# Altium schematic sheet DigitalPart.SchDoc
size 254 x 254 mm; PageSetup: Record=PageOptions|CenterHorizontal=False|CenterVertical=True|PrintScale=1.00|XCorrection=1.00|YCorrection=1.00|PrintKind=2|BorderSize=5000000|LeftOffset=0|BottomOffset=0|Orientation=1|PaperLength=1000|PaperWidth=1000|Scale=100|PaperSource=7|PrintQuality=-4|MediaType=1|DitherType=10|PaperKind=A4|PrintScaleMode=0
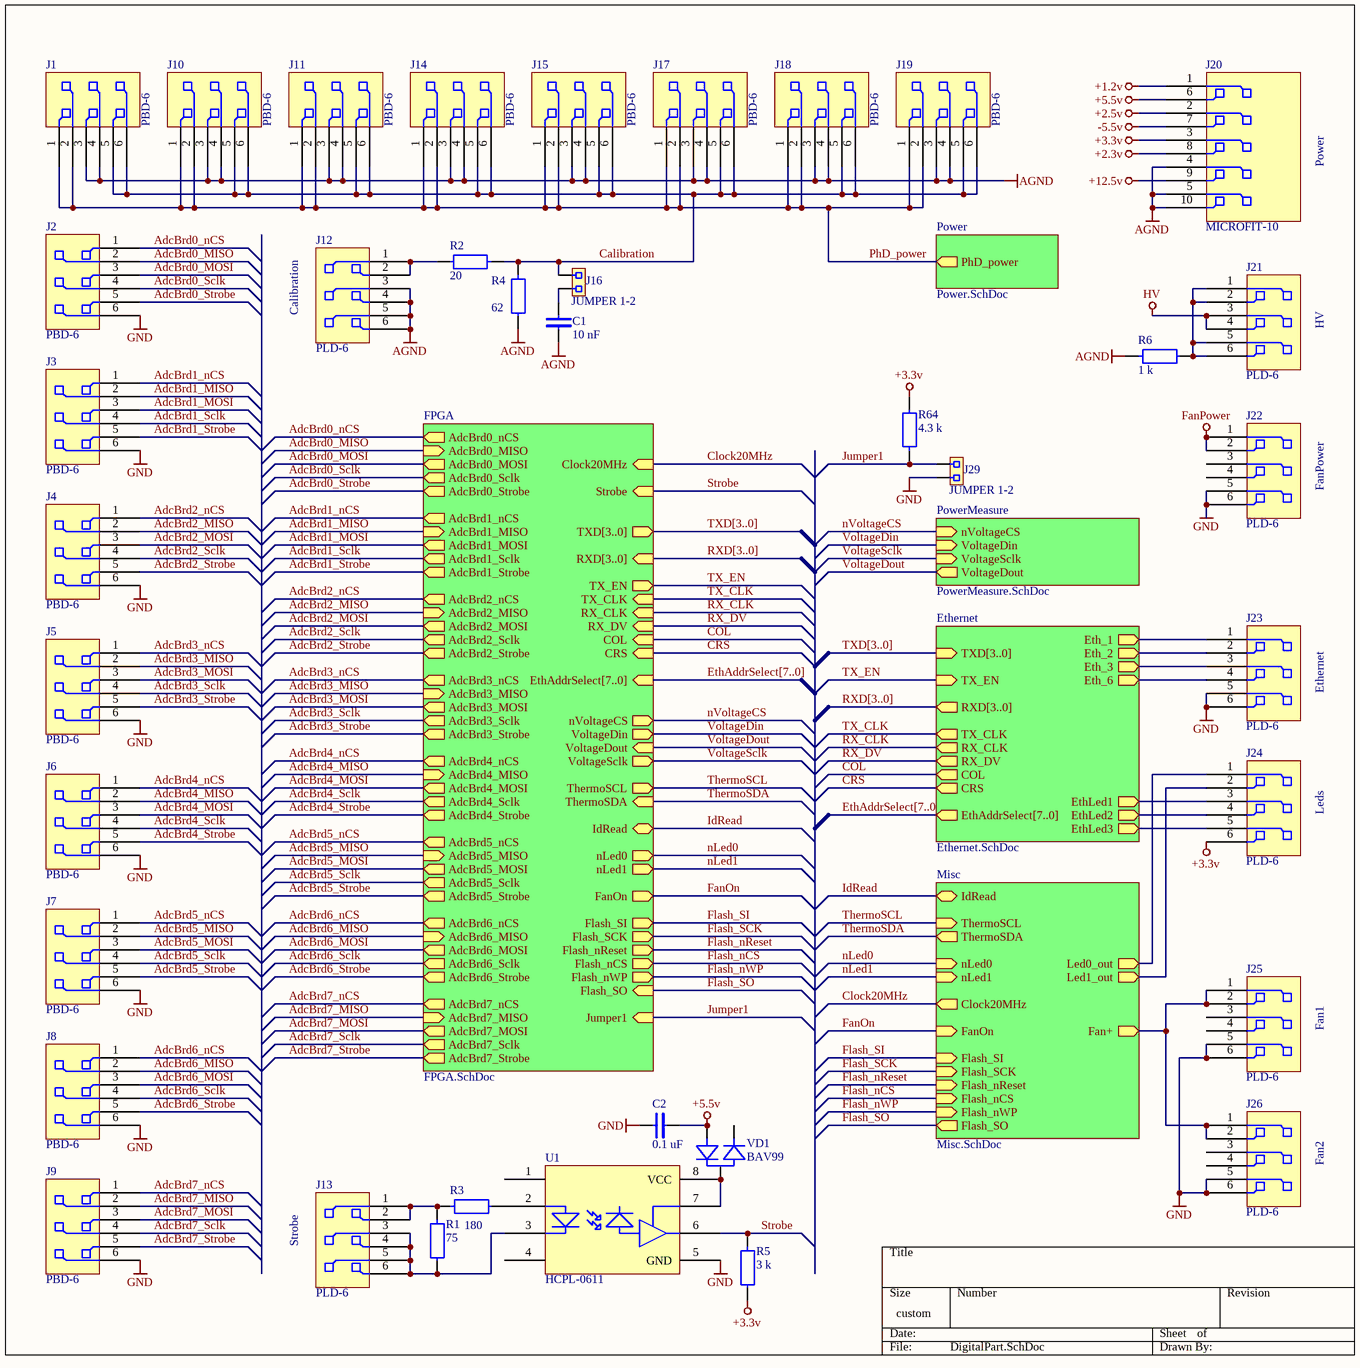
[diagram p0: DigitalPart.SchDoc]

## Parts
C1  10 nF  [1206]
C2  0.1 uF  [1206]
J1  PBD-6  [PBD-6]
J2  PBD-6  [PBD-6]
J3  PBD-6  [PBD-6]
J4  PBD-6  [PBD-6]
J5  PBD-6  [PBD-6]
J6  PBD-6  [PBD-6]
J7  PBD-6  [PBD-6]
J8  PBD-6  [PBD-6]
J9  PBD-6  [PBD-6]
J10  PBD-6  [PBD-6]
J11  PBD-6  [PBD-6]
J12  PLD-6  [PLD-6]
J13  PLD-6  [PLD-6]
J14  PBD-6  [PBD-6]
J15  PBD-6  [PBD-6]
J16  JUMPER 1-2  [2SIP]
J17  PBD-6  [PBD-6]
J18  PBD-6  [PBD-6]
J19  PBD-6  [PBD-6]
J20  MICROFIT-10  [MicroFit10]
J21  PLD-6  [PLD-6]
J22  PLD-6  [PLD-6]
J23  PLD-6  [PLD-6]
J24  PLD-6  [PLD-6]
J25  PLD-6  [PLD-6]
J26  PLD-6  [PLD-6]
J29  JUMPER 1-2  [2SIP]
R1  75  [1206]
R2  20  [1206]
R3  180  [1206]
R4  62  [1206]
R5  3 k  [1206]
R6  1 k  [1206]
R64  4.3 k  [0603]
U1  HCPL-0611  [8SOIC150]
VD1  BAV99  [SOT-23]

## Sub-sheets
Ethernet = Ethernet.SchDoc: COL (out), TX_EN (in), TX_CLK (out), RX_CLK (out), RX_DV (out), TXD[3..0] (in), RXD[3..0] (out), CRS (out), EthAddrSelect[7..0] (out), Eth_1 (out), Eth_2 (out), Eth_3 (out), Eth_6 (out), EthLed3 (out), EthLed2 (out), EthLed1 (out)
FPGA = FPGA.SchDoc: AdcBrd0_nCS (out), AdcBrd0_MISO (in), AdcBrd0_MOSI (out), AdcBrd0_Strobe (out), AdcBrd0_Sclk (out), nVoltageCS (out), VoltageDin (out), VoltageSclk (out), VoltageDout (in), COL (in), TX_EN (out), TX_CLK (in), RX_CLK (in), RX_DV (in), TXD[3..0] (out), CRS (in), RXD[3..0] (in), IdRead (bidir), ThermoSDA (in), Clock20MHz (in), ThermoSCL (out), nLed0 (out), nLed1 (out), Strobe (in), AdcBrd1_nCS (out), AdcBrd1_MISO (in), AdcBrd1_MOSI (out), AdcBrd1_Strobe (out), AdcBrd1_Sclk (out), AdcBrd2_nCS (out), AdcBrd2_MISO (in), AdcBrd2_MOSI (out), AdcBrd2_Strobe (out), AdcBrd2_Sclk (out), AdcBrd3_nCS (out), AdcBrd3_MISO (in), AdcBrd3_MOSI (out), AdcBrd3_Strobe (out), AdcBrd3_Sclk (out), AdcBrd4_nCS (out), AdcBrd4_MISO (in), AdcBrd4_MOSI (out), AdcBrd4_Strobe (out), AdcBrd4_Sclk (out), AdcBrd5_nCS (out), AdcBrd5_MISO (in), AdcBrd5_MOSI (out), AdcBrd5_Strobe (out), AdcBrd5_Sclk (out), AdcBrd6_nCS (out), AdcBrd6_MISO (in), AdcBrd6_MOSI (out), AdcBrd6_Strobe (out), AdcBrd6_Sclk (out), AdcBrd7_nCS (out), AdcBrd7_MISO (in), AdcBrd7_MOSI (out), AdcBrd7_Strobe (out), AdcBrd7_Sclk (out), EthAddrSelect[7..0] (in), FanOn (out), Flash_SI (out), Flash_SCK (out), Flash_nReset (out), Flash_nCS (out), Flash_nWP (out), Flash_SO (in), Jumper1 (in)
Misc = Misc.SchDoc: IdRead (bidir), ThermoSDA (out), Clock20MHz (out), ThermoSCL (in), nLed0 (in), nLed1 (in), Fan+ (out), FanOn (in), Flash_SI (in), Flash_SCK (in), Flash_nReset (in), Flash_nCS (in), Flash_nWP (in), Flash_SO (out), Led0_out (out), Led1_out (out)
Power = Power.SchDoc: PhD_power (out)
PowerMeasure = PowerMeasure.SchDoc: nVoltageCS (in), VoltageDin (in), VoltageSclk (in), VoltageDout (out)

## Nets
+1.2v: J20.1
+2.3v: J20.8
+2.5v: J20.2
+3.3v: J20.3 J24.6 R5.1 R64.1
+5.5v: C2.2 J20.6 VD1.1
+12.5v: J20.9
-5.5v: J20.7
AGND: C1.1 J1.3 J1.4 J10.3 J10.4 J11.3 J11.4 J12.3 J12.4 J12.5 J12.6 J14.3 J14.4 J15.3 J15.4 J17.3 J17.4 J18.3 J18.4 J19.3 J19.4 J20.4 J20.5 J20.10 R4.1 R6.2
FanPower: J22.1 J22.2
GND: C2.1 J2.6 J3.6 J4.6 J5.6 J6.6 J7.6 J8.6 J9.6 J22.5 J22.6 J23.5 J23.6 J25.5 J25.6 J26.5 J26.6 J29.2 U1.5(GND)
HV: J21.3 J21.4
AdcBrd0_MISO: J2.2 ; sheet FPGA/AdcBrd0_MISO
AdcBrd0_MOSI: J2.3 ; sheet FPGA/AdcBrd0_MOSI
AdcBrd0_nCS: J2.1 ; sheet FPGA/AdcBrd0_nCS
AdcBrd0_Sclk: J2.4 ; sheet FPGA/AdcBrd0_Sclk
AdcBrd0_Strobe: J2.5 ; sheet FPGA/AdcBrd0_Strobe
AdcBrd1_MISO: J3.2 ; sheet FPGA/AdcBrd1_MISO
AdcBrd1_MOSI: J3.3 ; sheet FPGA/AdcBrd1_MOSI
AdcBrd1_nCS: J3.1 ; sheet FPGA/AdcBrd1_nCS
AdcBrd1_Sclk: J3.4 ; sheet FPGA/AdcBrd1_Sclk
AdcBrd1_Strobe: J3.5 ; sheet FPGA/AdcBrd1_Strobe
AdcBrd2_MISO: J4.2 ; sheet FPGA/AdcBrd2_MISO
AdcBrd2_MOSI: J4.3 ; sheet FPGA/AdcBrd2_MOSI
AdcBrd2_nCS: J4.1 ; sheet FPGA/AdcBrd2_nCS
AdcBrd2_Sclk: J4.4 ; sheet FPGA/AdcBrd2_Sclk
AdcBrd2_Strobe: J4.5 ; sheet FPGA/AdcBrd2_Strobe
AdcBrd3_MISO: J5.2 ; sheet FPGA/AdcBrd3_MISO
AdcBrd3_MOSI: J5.3 ; sheet FPGA/AdcBrd3_MOSI
AdcBrd3_nCS: J5.1 ; sheet FPGA/AdcBrd3_nCS
AdcBrd3_Sclk: J5.4 ; sheet FPGA/AdcBrd3_Sclk
AdcBrd3_Strobe: J5.5 ; sheet FPGA/AdcBrd3_Strobe
AdcBrd4_MISO: J6.2 ; sheet FPGA/AdcBrd4_MISO
AdcBrd4_MOSI: J6.3 ; sheet FPGA/AdcBrd4_MOSI
AdcBrd4_nCS: J6.1 ; sheet FPGA/AdcBrd4_nCS
AdcBrd4_Sclk: J6.4 ; sheet FPGA/AdcBrd4_Sclk
AdcBrd4_Strobe: J6.5 ; sheet FPGA/AdcBrd4_Strobe
AdcBrd5_MISO: J7.2 ; sheet FPGA/AdcBrd5_MISO
AdcBrd5_MOSI: J7.3 ; sheet FPGA/AdcBrd5_MOSI
AdcBrd5_nCS: J7.1 ; sheet FPGA/AdcBrd5_nCS
AdcBrd5_Sclk: J7.4 ; sheet FPGA/AdcBrd5_Sclk
AdcBrd5_Strobe: J7.5 ; sheet FPGA/AdcBrd5_Strobe
AdcBrd6_MISO: J8.2 ; sheet FPGA/AdcBrd6_MISO
AdcBrd6_MOSI: J8.3 ; sheet FPGA/AdcBrd6_MOSI
AdcBrd6_nCS: J8.1 ; sheet FPGA/AdcBrd6_nCS
AdcBrd6_Sclk: J8.4 ; sheet FPGA/AdcBrd6_Sclk
AdcBrd6_Strobe: J8.5 ; sheet FPGA/AdcBrd6_Strobe
AdcBrd7_MISO: J9.2 ; sheet FPGA/AdcBrd7_MISO
AdcBrd7_MOSI: J9.3 ; sheet FPGA/AdcBrd7_MOSI
AdcBrd7_nCS: J9.1 ; sheet FPGA/AdcBrd7_nCS
AdcBrd7_Sclk: J9.4 ; sheet FPGA/AdcBrd7_Sclk
AdcBrd7_Strobe: J9.5 ; sheet FPGA/AdcBrd7_Strobe
Calibration: J1.5 J1.6 J10.5 J10.6 J11.5 J11.6 J14.5 J14.6 J15.5 J15.6 J16.1 J17.5 J17.6 J18.5 J18.6 J19.5 J19.6 R2.2 R4.2
Clock20MHz: sheet FPGA/Clock20MHz, sheet Misc/Clock20MHz
COL: sheet FPGA/COL, sheet Ethernet/COL
CRS: sheet FPGA/CRS, sheet Ethernet/CRS
FanOn: sheet FPGA/FanOn, sheet Misc/FanOn
Flash_nCS: sheet FPGA/Flash_nCS, sheet Misc/Flash_nCS
Flash_nReset: sheet FPGA/Flash_nReset, sheet Misc/Flash_nReset
Flash_nWP: sheet FPGA/Flash_nWP, sheet Misc/Flash_nWP
Flash_SCK: sheet FPGA/Flash_SCK, sheet Misc/Flash_SCK
Flash_SI: sheet FPGA/Flash_SI, sheet Misc/Flash_SI
Flash_SO: sheet FPGA/Flash_SO, sheet Misc/Flash_SO
IdRead: sheet FPGA/IdRead, sheet Misc/IdRead
Jumper1: J29.1 R64.2 ; sheet FPGA/Jumper1
nLed0: sheet FPGA/nLed0, sheet Misc/nLed0
nLed1: sheet FPGA/nLed1, sheet Misc/nLed1
nVoltageCS: sheet PowerMeasure/nVoltageCS, sheet FPGA/nVoltageCS
PhD_power: J1.1 J1.2 J10.1 J10.2 J11.1 J11.2 J14.1 J14.2 J15.1 J15.2 J17.1 J17.2 J18.1 J18.2 J19.1 J19.2 ; sheet Power/PhD_power
RX_CLK: sheet FPGA/RX_CLK, sheet Ethernet/RX_CLK
RX_DV: sheet FPGA/RX_DV, sheet Ethernet/RX_DV
Strobe: R5.2 U1.6(Out) ; sheet FPGA/Strobe
ThermoSCL: sheet FPGA/ThermoSCL, sheet Misc/ThermoSCL
ThermoSDA: sheet FPGA/ThermoSDA, sheet Misc/ThermoSDA
TX_CLK: sheet FPGA/TX_CLK, sheet Ethernet/TX_CLK
TX_EN: sheet FPGA/TX_EN, sheet Ethernet/TX_EN
VoltageDin: sheet PowerMeasure/VoltageDin, sheet FPGA/VoltageDin
VoltageDout: sheet PowerMeasure/VoltageDout, sheet FPGA/VoltageDout
VoltageSclk: sheet PowerMeasure/VoltageSclk, sheet FPGA/VoltageSclk
NetC1_2: C1.2 J16.2
NetJ12_1: J12.1 J12.2 R2.1
NetJ13_1: J13.1 J13.2 R1.2 R3.2
NetJ13_3: J13.3 J13.4 J13.5 J13.6 R1.1 U1.3(In-)
NetJ21_1: J21.1 J21.2 J21.5 J21.6 R6.1
NetJ23_1: J23.1 ; sheet Ethernet/Eth_1
NetJ23_2: J23.2 ; sheet Ethernet/Eth_2
NetJ23_3: J23.3 ; sheet Ethernet/Eth_3
NetJ23_4: J23.4 ; sheet Ethernet/Eth_6
NetJ24_1: J24.1 ; sheet Misc/Led0_out
NetJ24_2: J24.2 ; sheet Misc/Led1_out
NetJ24_3: J24.3 ; sheet Ethernet/EthLed1
NetJ24_4: J24.4 ; sheet Ethernet/EthLed2
NetJ24_5: J24.5 ; sheet Ethernet/EthLed3
NetJ25_1: J25.1 J25.2 J26.1 J26.2 ; sheet Misc/Fan+
NetR3_1: R3.1 U1.2(In+)
NetU1_7: U1.7(Ve) U1.8(VCC) VD1.3

Not connected (* = marked no-connect by the designer): J22 3 4; J25 3 4; J26 3 4; U1 1(NC) 4(NC); VD1 2

## Buses and harness runs
bus EthAddrSelect[7..0] = sheet Ethernet/EthAddrSelect[7..0]
bus EthAddrSelect[7..0] = sheet FPGA/EthAddrSelect[7..0]
bus RXD[3..0] = sheet Ethernet/RXD[3..0]
bus RXD[3..0] = sheet FPGA/RXD[3..0]
bus TXD[3..0] = sheet Ethernet/TXD[3..0]
bus TXD[3..0] = sheet FPGA/TXD[3..0]

## Notes on the sheet
- Power
- Calibration
- HV
- FanPower
- Ethernet
- Leds
- Fan1
- Fan2
- Strobe

## Library data of the parts
C1 C2 = C
J1-J11 J14 J15 J17-J19 = PBD-6: Socket, double line, 2.54 mm and 2 mm,
J16 J29 = JUMPER 1-2: 2.54 mm jumper
R1 R3 R5 R64 = R
R2 R4 R6 = r
VD1 = BAV99: Double diode